# EAGLE design Compressor (EAGLE 7.2.0)
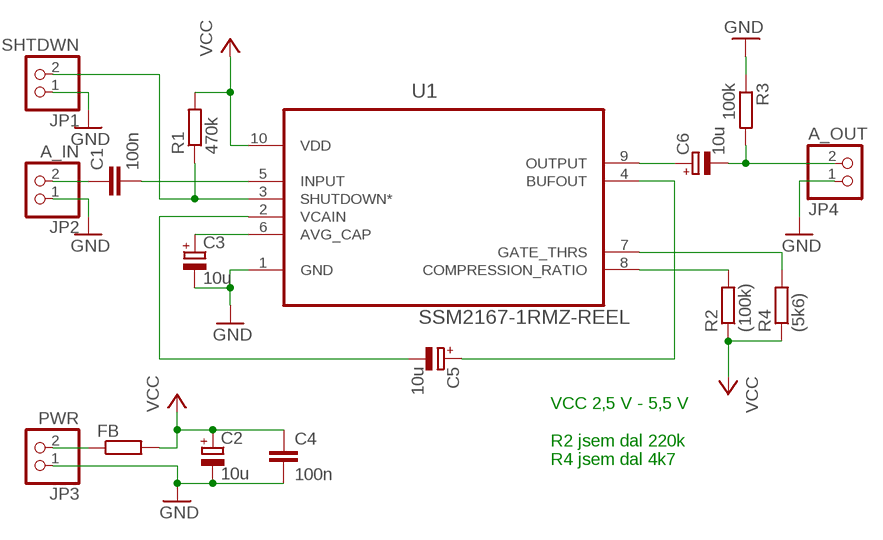
[diagram p0: schematic, sheet 1]

## Parts
C1  100n  C-EUC0603  [C0603]
C2  10u  CPOL-EUSMCA  [SMC_A]
C3  10u  CPOL-EUSMCA  [SMC_A]
C4  100n  C-EUC0603  [C0603]
C5  10u  CPOL-EUSMCA  [SMC_A]
C6  10u  CPOL-EUSMCA  [SMC_A]
FB  R-EU_R0603  [R0603]
JP1  SHTDWN  PINHD-1X2  [1X02]
JP2  A_IN  PINHD-1X2  [1X02]
JP3  PWR  PINHD-1X2  [1X02]
JP4  A_OUT  PINHD-1X2  [1X02]
R1  470k  R-EU_R0603  [R0603]
R2  (100k)  R-EU_R0603  [R0603]
R3  100k  R-EU_R0603  [R0603]
R4  (5k6)  R-EU_R0603  [R0603]
U1  SSM2167-1RMZ-REEL  [SOP50P490X110-10N]

## Nets
GND: C2.- C3.- C4.2 JP1.1 JP2.1 JP3.1 JP4.1 R3.1 U1.1(GND)
N$1: C1.1 JP2.2
N$2: C1.2 U1.5(INPUT)
N$3: C5.- U1.2(VCAIN)
N$4: C5.+ U1.4(BUFOUT)
N$5: C3.+ U1.6(AVG_CAP)
N$6: JP1.2 R1.1 U1.3(SHUTDOWN*)
N$7: R2.2 U1.8(COMPRESSION_RATIO)
N$8: R4.2 U1.7(GATE_THRS)
N$9: C6.+ U1.9(OUTPUT)
N$10: C6.- JP4.2 R3.2
N$11: FB.1 JP3.2
VCC: C2.+ C4.1 FB.2 R1.2 R2.1 R4.1 U1.10(VDD)

## Notes on the sheet
- VCC 2,5 V - 5,5 V
  
  R2 jsem dal 220k
  R4 jsem dal 4k7

## Library data of the parts
C1 C4 = rcl:C-EU: CAPACITOR, European symbol
C2 C3 C5 C6 = rcl:CPOL-EU: POLARIZED CAPACITOR, European symbol
FB R1-R4 = rcl:R-EU_: RESISTOR, European symbol
JP1-JP4 = pinhead:PINHD-1X2: PIN HEADER
U1 = ADI-Phase-2:SSM2167-1RMZ-REEL: Low Voltage Microphone Preamplifier with Variable Compression; MPN: SSM2167-1RMZ-REEL; OC_FARNELL: 2148620; OC_NEWARK: 88H0694; PACKAGE: MSOP-10; SUPPLIER: Analog Devices

## Board
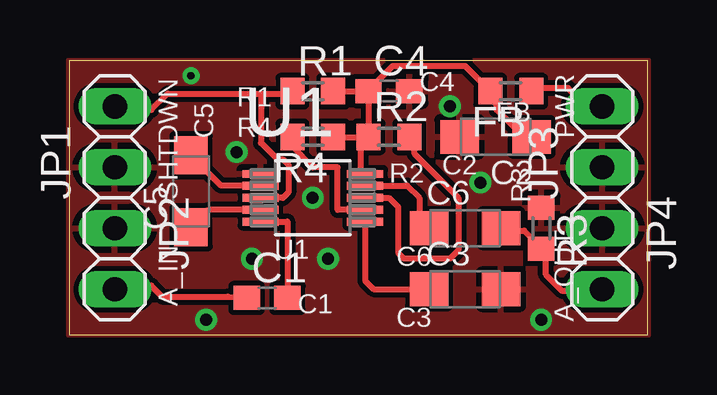
[diagram p1: board, top side]
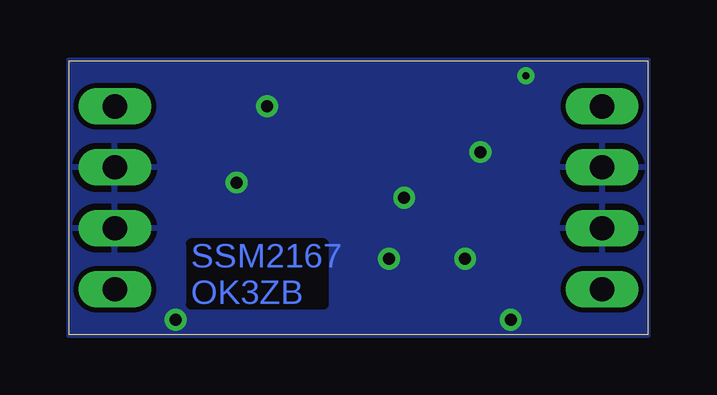
[diagram p2: board, bottom side, seen from below]

Size 24.13 x 11.42 mm. Coordinates in mm from the lower left corner, seen from the top.
Outline: 0,0 24.13,0 24.13,11.42 0,11.42 0,0
Copper layers (1*16): Top 0.035mm / dielectric 1.5mm / Bottom 0.035mm
Design rules "default *": minimum track width 10mil, minimum drill 24mil, track to track 8mil, track to pad 8mil, pad to pad 8mil, via to via 8mil, smd to smd 8mil, copper to edge 0mil, drill to drill 8mil, minimum pad ring 10mil, minimum via ring 8mil, stop-mask expansion 4mil, vias tented up to drill 0mil, thermal gap 10mil

### Footprints (pad centres in the part's own frame; a part is rotated, then mirrored left to right if it is on the bottom)
C0603 = smd 1.1 x 1: 1 -0.85,0; 2 0.85,0
SMC_A = smd 1.6 x 1.4: + -1.5,0; - 1.5,0
R0603 = smd 1 x 1.1: 1 -0.85,0; 2 0.85,0
1X02 = drill 1.016 long: 1 -1.27,0; 2 1.27,0
SOP50P490X110-10N = smd 1.499 x 0.33: 1 -2.184,0.991; 2 -2.184,0.508; 3 -2.184,0; 4 -2.184,-0.508; 5 -2.184,-0.991; 6 2.184,-0.991; 7 2.184,-0.508; 8 2.184,0; 9 2.184,0.508; 10 2.184,0.991

### Placement (x,y rotation side)
C1  8.26,1.54 0 top
C2  17.78,8.26 180 top
C3  16.51,1.91 0 top
C4  13.34,10.16 0 top
C5  5.08,5.99 90 top
C6  16.51,4.45 0 top
FB  18.41,10.16 180 top
JP1  1.91,8.26 90 top
JP2  1.91,3.17 270 top
JP3  22.23,8.26 90 top
JP4  22.23,3.17 270 top
R1  10.16,10.16 0 top
R2  13.34,8.26 0 top
R3  19.68,4.45 270 top
R4  10.16,8.26 180 top
U1  10.16,5.71 0 top

### Tracks (layer width: path | path; a pad name or v marks a point on that pad's centre or on a via)
GND  (via drill 0.3, 0.5)
  other vias: 10.16,5.71 7.62,3.17 15.88,9.53 6.99,7.62 17.14,6.35 10.79,3.17 5.71,0.64 19.68,0.64 5.08,10.79
  pour Bottom: 0,11.43 24.13,11.43 24.13,0 0,0
  pour Top: 0,11.43 24.13,11.43 24.13,0 0,0
N$1
  Top 0.254: C1.1 6.63,1.6 3.89,1.6 3.43,2.06 2.06,2.06 JP2.2
N$2
  Top 0.254: U1.5 9.11,4.72 C1.2
N$3
  Top 0.254: U1.2 6.34,6.22 C5.-
N$4
  Top 0.254: U1.4 5.8,5.21 C5.+
N$5
  Top 0.254: U1.6 12.34,2.26 12.7,1.91 C3.+
N$6
  Top 0.254: 8,10.06 4.12,10.06 3.43,9.37 2.06,9.37 JP1.2 | 8,10.06 9.14,10.06 R1.1 | 8,10.06 8,8 8.69,7.32 8.91,7.32 9.14,7.09 9.14,5.94 8.91,5.71 U1.3
N$7
  Top 0.254: 14.17,8.23 R2.2 14.4,8.23 14.4,7.54 16.23,5.71 16.23,3.53 15.88,3.17 13.97,3.17 13.72,3.43 13.72,5.33 13.34,5.71 U1.8
N$8
  Top 0.254: U1.7 11.2,5.21 11.2,6.99 10.16,6.99 9.31,7.83 R4.2
N$9
  Top 0.254: U1.9 14.1,6.22 14.61,5.71 14.61,4.85 C6.+
N$10
  Top 0.254: C6.- 18.06,4.34 18.97,4.34 19.66,3.66 R3.2 19.89,3.43 19.89,2.52 20.57,1.83 22.17,1.83 JP4.2
N$11
  Top 0.254: FB.1 19.43,10.29 20.8,10.29 21.49,9.6 22.17,9.6 JP3.2
VCC
  Top 0.254: U1.10 12.14,6.78 12.14,8.15 12.12,8.23 12.34,8.23 R2.1 | R4.1 11.2,8.23 12.48,8.23 R2.1 | C2.+ 19.2,8.46 18.75,8.46 17.83,9.37 17.83,9.6 17.6,9.83 17.6,10.06 FB.2 16.52,11.2 13.49,11.2 12.57,10.29 C4.1 | C4.1 R2.1 | R1.2 C4.1

### Text on the board
Bottom: SSM2167 / OK3ZB
_tNames: PWR | R1 | C4 | FB | C5 | R4 | C2 | R3 | SHTDWN | R2 | U1 | C6 | A_IN | C1 | A_OUT | C3